# EAGLE design Portaqua (EAGLE 9.6.2)
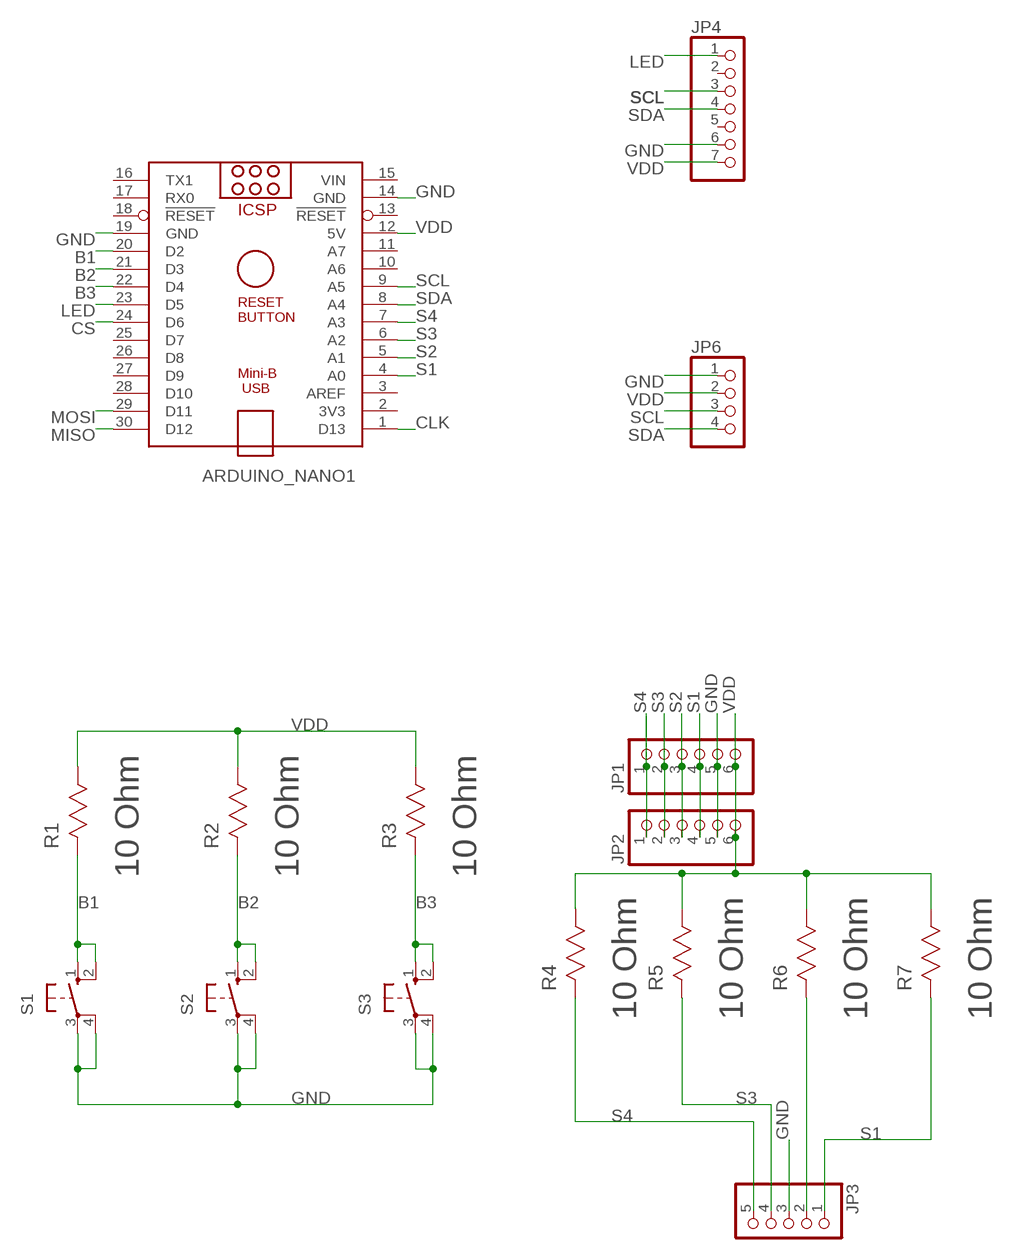
[diagram p0: schematic, sheet 1]

## Parts
ARDUINO_NANO1  ARDUINO_NANO  [ARDUINO_NANO]
JP1  PINHD-1X6  [1X06]
JP2  PINHD-1X6  [1X06]
JP3  PINHD-1X05_2.54-SMD-90°  [1X05SMD/90]
JP4  PINHD-1X7  [1X07]
JP6  PINHD-1X4  [1X04]
R1  10 Ohm  CRM1206-FX-10R0ELF  [RESC3216X71N]
R2  10 Ohm  CRM1206-FX-10R0ELF  [RESC3216X71N]
R3  10 Ohm  CRM1206-FX-10R0ELF  [RESC3216X71N]
R4  10 Ohm  CRM1206-FX-10R0ELF  [RESC3216X71N]
R5  10 Ohm  CRM1206-FX-10R0ELF  [RESC3216X71N]
R6  10 Ohm  CRM1206-FX-10R0ELF  [RESC3216X71N]
R7  10 Ohm  CRM1206-FX-10R0ELF  [RESC3216X71N]
S1  10-XX  [B3F-10XX]
S2  10-XX  [B3F-10XX]
S3  10-XX  [B3F-10XX]

## Nets
B1: ARDUINO_NANO1.20(D2) R1.2(R2) S1.1(S) S1.2(S1)
B2: ARDUINO_NANO1.21(D3) R2.2(R2) S2.1(S) S2.2(S1)
B3: ARDUINO_NANO1.22(D4) R3.2(R2) S3.1(S) S3.2(S1)
CLK: ARDUINO_NANO1.1(D13)
CS: ARDUINO_NANO1.24(D6)
GND: ARDUINO_NANO1.14(GND) ARDUINO_NANO1.19(GND) JP1.5 JP2.5 JP3.3 JP4.6 JP6.1 S1.3(P) S1.4(P1) S2.3(P) S2.4(P1) S3.3(P) S3.4(P1)
LED: ARDUINO_NANO1.23(D5) JP4.1
MISO: ARDUINO_NANO1.30(D12)
MOSI: ARDUINO_NANO1.29(D11)
N$1: JP3.2 R6.2(R2)
S1: ARDUINO_NANO1.4(A0) JP1.4 JP2.4 JP3.1 R7.2(R2)
S2: ARDUINO_NANO1.5(A1) JP1.3 JP2.3
S3: ARDUINO_NANO1.6(A2) JP1.2 JP2.2 JP3.4 R5.2(R2)
S4: ARDUINO_NANO1.7(A3) JP1.1 JP2.1 JP3.5 R4.2(R2)
SCL: ARDUINO_NANO1.9(A5) JP4.3 JP6.3
SDA: ARDUINO_NANO1.8(A4) JP4.4 JP6.4
VDD: ARDUINO_NANO1.12(5V) JP1.6 JP2.6 JP4.7 JP6.2 R1.1(R1) R2.1(R1) R3.1(R1) R4.1(R1) R5.1(R1) R6.1(R1) R7.1(R1)
Unconnected: ARDUINO_NANO1.2(3V3) ARDUINO_NANO1.3(AREF) ARDUINO_NANO1.10(A6) ARDUINO_NANO1.11(A7) ARDUINO_NANO1.13(!RESET) ARDUINO_NANO1.16(TX1) ARDUINO_NANO1.17(RX0) ARDUINO_NANO1.18(!RESET) ARDUINO_NANO1.25(D7) ARDUINO_NANO1.26(D8) ARDUINO_NANO1.27(D9) ARDUINO_NANO1.28(D10) JP4.2 JP4.5

## Power pins joined to a net without a drawn wire
VIN: ARDUINO_NANO1.15(VIN)

## Library data of the parts
ARDUINO_NANO1 = ArduinoNanoV30:ARDUINO_NANO: Arduino Nano V3.0 Overview: The Arduino Nano is a small, complete, and breadboard-friendly board based on the ATmega328 (Arduino Nano 3.x) or ATmega168 (Arduino Nano 2.x). It has more or less the same functionality of the Arduino Duemilanove, but in a different package. It lacks only a DC power jack, and works with a Mini-B USB cable instead of a standard one. The Nano was designed and is being produced by Gravitech. Specifications: Microcontroller Atmel ATmega168 or ATmega328 Operating Voltage (logic level) 5 V Input Voltage (recommended) 7-12 V Input Voltage (limits) 6-20 V Digital I/O Pins 14 (of which 6 provide PWM output) Analog Input Pins 8 DC Current per I/O Pin 40 mA Flash Memory 16 KB (ATmega168) or 32 KB (ATmega328) of which 2 KB used by bootloader SRAM 1 KB (ATmega168) or 2 KB (ATmega328) EEPROM 512 bytes (ATmega168) or 1 KB (ATmega328) Clock Speed 16 MHz Dimensions 0.73" x 1.70" Length 45 mm Width 18 mm Weigth 5 g Power: The Arduino Nano can be powered via the Mini-B USB connection, 6-20V unregulated external power supply (pin 30), or 5V regulated external power supply (pin 27). The power source is automatically selected to the highest voltage source. Memory: The ATmega168 has 16 KB of flash memory for storing code (of which 2 KB is used for the bootloader); the ATmega328 has 32 KB, (also with 2 KB used for the bootloader). The ATmega168 has 1 KB of SRAM and 512 bytes of EEPROM (which can be read and written with the EEPROM library); the ATmega328 has 2 KB of SRAM and 1 KB of EEPROM. Input and Output: Each of the 14 digital pins on the Nano can be used as an input or output, using pinMode(), digitalWrite(), and digitalRead() functions. They operate at 5 volts. Each pin can provide or receive a maximum of 40 mA and has an internal pull-up resistor (disconnected by default) of 20-50 kOhms. In addition, some pins have specialized functions. Visit Arduino - ArduinoBoardNano <https://www.arduino.cc/en/Main/ArduinoBoardNano>
JP1 JP2 = pinhead:PINHD-1X6: PIN HEADER
JP3 = pinhead-2:PINHD-1X05: PIN HEADER
JP4 = pinhead:PINHD-1X7: PIN HEADER
JP6 = pinhead:PINHD-1X4: PIN HEADER
R1-R7 = Bourns_By_element14_Batch_1:CRM1206-FX-10R0ELF: Resistor 1206; MPN: CRM1206-FX-10R0ELF; OC_FARNELL: 1865248; OC_NEWARK: 17T4257; SUPPLIER: BOURNS; TOLERANCE: ±1 %; WATTAGE: 0.5W
S1-S3 = switch-omron:10-XX: OMRON SWITCH; MPN: B3F-1000; OC_FARNELL: 176432; OC_NEWARK: 36M3542

## Board
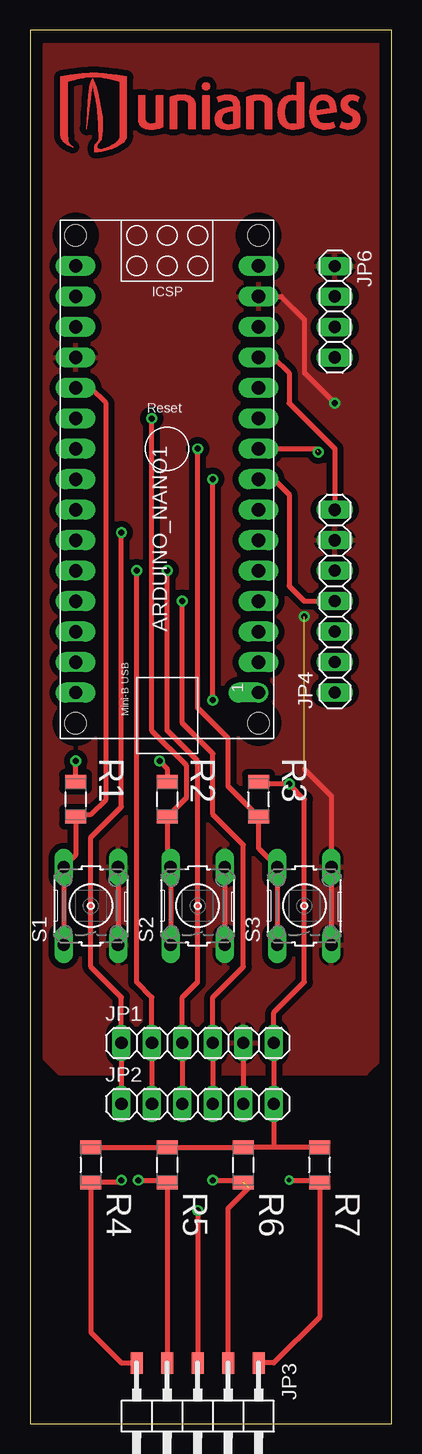
[diagram p1: board, top side]
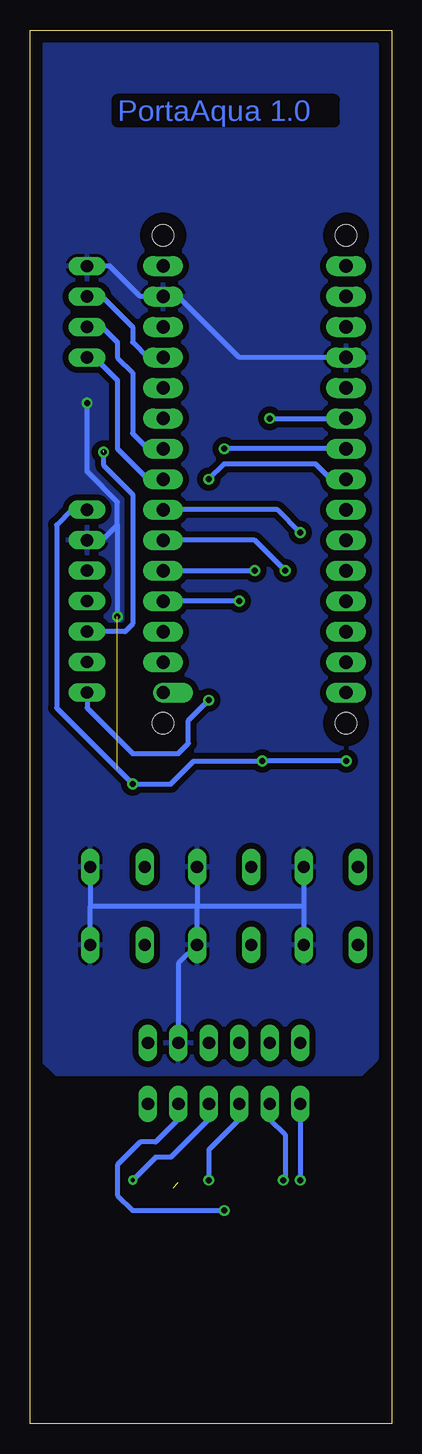
[diagram p2: board, bottom side, seen from below]

Size 30.15 x 116.2 mm. Coordinates in mm from the lower left corner, seen from the top.
Outline: 0,0 30.15,0 30.15,116.2 0,116.2 0,0
Copper layers (1*16): Top 0.035mm / dielectric 1.5mm / Bottom 0.035mm
Design rules "default *": minimum track width 6mil, minimum drill 0.35mm, track to track 20mil, track to pad 20mil, pad to pad 20mil, via to via 20mil, smd to smd 20mil, copper to edge 40mil, drill to drill 6mil, minimum pad ring 10mil, minimum via ring 8mil, stop-mask expansion 4mil, vias tented up to drill 0mil, thermal gap 10mil

### Footprints (pad centres in the part's own frame; a part is rotated, then mirrored left to right if it is on the bottom)
ARDUINO_NANO = drill 1.11 offset: 1 -20.32,-7.62 | drill 1.11 long: 2 -17.78,-7.62; 3 -15.24,-7.62; 4 -12.7,-7.62; 5 -10.16,-7.62; 6 -7.62,-7.62; 7 -5.08,-7.62; 8 -2.54,-7.62; 9 0,-7.62; 10 2.54,-7.62; 11 5.08,-7.62; 12 7.62,-7.62; 13 10.16,-7.62; 14 12.7,-7.62; 15 15.24,-7.62; 16 15.24,7.62; 17 12.7,7.62; 18 10.16,7.62; 19 7.62,7.62; 20 5.08,7.62; 21 2.54,7.62; 22 0,7.62; 23 -2.54,7.62; 24 -5.08,7.62; 25 -7.62,7.62; 26 -10.16,7.62; 27 -12.7,7.62; 28 -15.24,7.62; 29 -17.78,7.62; 30 -20.32,7.62 | hole 1.778: -22.86,-7.62; -22.86,7.62; 17.78,7.62; 17.78,-7.62
1X06 = drill 1.016 long: 1 -6.35,0; 2 -3.81,0; 3 -1.27,0; 4 1.27,0; 5 3.81,0; 6 6.35,0
1X05SMD/90 = smd 1.016 x 1.778: 1 -1.27,-5.08; 2 1.27,-5.08; 3 3.81,-5.08; 4 6.35,-5.08; 5 8.89,-5.08
1X07 = drill 1.016 long: 1 -7.62,0; 2 -5.08,0; 3 -2.54,0; 4 0,0; 5 2.54,0; 6 5.08,0; 7 7.62,0
1X04 = drill 1.016 long: 1 -3.81,0; 2 -1.27,0; 3 1.27,0; 4 3.81,0
RESC3216X71N = smd 1.118 x 1.753: 1 -1.473,0; 2 1.473,0
B3F-10XX = drill 1.016 long: 1 -3.251,2.261; 2 3.251,2.261; 3 -3.251,-2.261; 4 3.251,-2.261

### Placement (x,y rotation side)
ARDUINO_NANO1  11.43,81.28 90 top
JP1  13.97,31.75 0 top
JP2  13.97,26.67 0 top
JP3  17.78,0 180 top
JP4  25.4,68.58 90 top
JP6  25.4,92.71 270 top
R1  3.81,52.07 270 top
R2  11.43,52.07 270 top
R3  19.05,52.07 270 top
R4  5.08,21.59 270 top
R5  11.43,21.59 270 top
R6  17.78,21.59 270 top
R7  24.13,21.59 270 top
S1  5.08,43.18 90 top
S2  13.97,43.18 90 top
S3  22.86,43.18 90 top
U$1  [UNIANDES25MM]  2.54,106.05 0 top

### Tracks (layer width: path | path; a pad name or v marks a point on that pad's centre or on a via)
B1
  Top 0.406: S1.1 S1.2 3.81,47.42 R1.2 4.01,50.8 5.08,50.8 6.35,52.07 6.35,85.09 5.08,86.36 ARDUINO_NANO1.20
B2  (via drill 0.5)
  Top 0.406: S2.1 S2.2 11.43,46.71 R2.2 13.06,52.22 13.06,54.87 10.16,57.76 v10.16,83.82
  Bottom 0.406: v10.16,83.82 ARDUINO_NANO1.21
B3  (via drill 0.5)
  Top 0.406: S3.1 S3.2 19.05,47.98 R3.2 16.51,53.14 16.51,57.15 13.97,59.69 v13.97,81.28
  Bottom 0.406: ARDUINO_NANO1.22 v13.97,81.28
GND  (via drill 0.5)  (1 unrouted)
  Top 0.406: JP1.5 JP2.5 | v25.4,85.09 22.86,87.63 22.86,92.08 20.95,93.98 ARDUINO_NANO1.14 | 22.86,54.61 25.12,52.35 S3.4 S3.3 | S2.4 S2.3 | S1.4 S1.3 | v13.97,17.78 JP3.3
  Bottom 0.406: S1.4 7.34,43.18 | 7.34,43.18 S1.3 | S2.4 16.23,43.18 | 16.23,43.18 S2.3 17.78,38.38 JP1.5 | S3.4 25.12,43.18 | S3.3 25.12,43.18 | 25.12,43.18 16.23,43.18 | 16.23,43.18 7.34,43.18 | v13.97,17.78 21.59,17.78 22.86,19.05 22.86,21.59 20.95,23.5 19.68,23.5 17.78,25.4 JP2.5 | ARDUINO_NANO1.19 12.7,88.9 17.78,93.98 ARDUINO_NANO1.14 20.95,93.98 23.5,96.52 JP6.1 | JP4.6 24.13,73.66 22.86,74.93 | 22.86,74.93 22.86,76.84 25.4,79.38 v25.4,85.09 | 22.86,74.93 v22.86,67.31
  pour Top: 1.27,114.94 29.21,114.94 29.21,30.48 27.94,29.21 2.54,29.21 1.27,30.48
  pour Bottom: 2.54,29.21 1.27,30.48 1.27,114.94 29.21,114.94 29.21,30.48 27.94,29.21
LED  (via drill 0.5)
  Top 0.406: v15.24,60.33 v15.24,78.74
  Bottom 0.406: JP4.1 25.4,59.69 21.59,55.88 17.78,55.88 16.94,56.72 16.94,58.62 v15.24,60.33 | ARDUINO_NANO1.23 5.08,78.74 6.35,80.01 13.97,80.01 v15.24,78.74
N$1  (1 unrouted)
  Top 0.406: JP3.2 16.51,17.96 18.22,19.67
S1  (via drill 0.35, 0.5)
  Top 0.406: JP2.4 JP1.4 15.24,35.56 17.78,38.1 17.78,48.26 15.24,50.8 15.24,55.88 12.7,58.42 v12.7,68.58 | v21.59,20.32 23.93,20.32 R7.2 24.13,8.89 20.32,5.08 JP3.1
  Bottom 0.406: v21.59,20.32 19.68,22.22 18.41,22.22 15.24,25.4 JP2.4 | v12.7,68.58 ARDUINO_NANO1.4
S2  (via drill 0.5)
  Top 0.406: JP2.3 JP1.3 12.7,35.56 13.97,36.83 13.97,55.25 11.43,57.78 v11.43,71.12 | v15.24,20.32 17.58,20.32
  Bottom 0.406: v15.24,20.32 15.24,22.86 12.7,25.4 JP2.3 | ARDUINO_NANO1.5 v11.43,71.12
S3  (via drill 0.5)
  Top 0.406: JP2.2 JP1.2 10.16,35.56 8.89,36.83 v8.89,71.12 | v9.03,20.32 11.23,20.32 R5.2 JP3.4
  Bottom 0.406: JP2.2 10.16,25.4 8.89,24.13 8.89,20.32 v9.03,20.32 | ARDUINO_NANO1.6 11.43,73.66 v8.89,71.12
S4  (via drill 0.5)
  Top 0.406: JP2.1 JP1.1 7.62,35.56 5.08,38.1 5.08,48.89 7.62,51.44 v7.62,74.3 | v7.62,20.32 7.42,20.12 R4.2 5.08,7.62 7.62,5.08 JP3.5
  Bottom 0.406: JP2.1 v7.62,20.32 | ARDUINO_NANO1.7 9.53,76.2 v7.62,74.3
SCL  (via drill 0.5)  (1 unrouted)
  Top 0.406: 24,81.14 23.86,81.28 ARDUINO_NANO1.9
  Bottom 0.406: JP6.3 24.13,91.44 22.86,90.17 22.86,88.9 21.59,87.63 21.59,82.55 20.32,81.28 ARDUINO_NANO1.9 | JP4.3 22.23,66.04 21.59,66.67 21.59,77.47 24,79.88 24,81.14 24.02,81.12 v24.02,81.01
SDA
  Top 0.406: ARDUINO_NANO1.8 20.32,78.74 21.59,77.47 21.59,69.85 22.86,68.58 JP4.4
  Bottom 0.406: ARDUINO_NANO1.8 20.32,78.74 21.59,80.01 22.86,81.28 22.86,82.55 22.86,87 24.77,88.9 JP6.4
VDD  (via drill 0.5)
  Top 0.406: R4.1 R5.1 R6.1 20.32,23.06 | R7.1 20.32,23.06 | 20.32,23.06 JP2.6 JP1.6 20.32,34.29 22.86,36.83 22.86,52.07 v21.59,53.34 19.25,53.34 R3.1 | ARDUINO_NANO1.12 20.32,88.9 21.59,87.63 21.59,85.09 25.4,81.28 JP4.7 | v10.79,55.25 11.43,54.61 R2.1 | R1.1 v3.81,55.25
  Bottom 0.406: JP6.2 24.13,93.98 21.59,91.44 21.59,90.17 20.32,88.9 ARDUINO_NANO1.12 | JP4.7 26.67,76.2 27.94,74.93 27.94,59.69 v21.59,53.34 18.41,53.34 16.51,55.25 v10.79,55.25 v3.81,55.25

### Text on the board
Bottom: PortaAqua 1.0